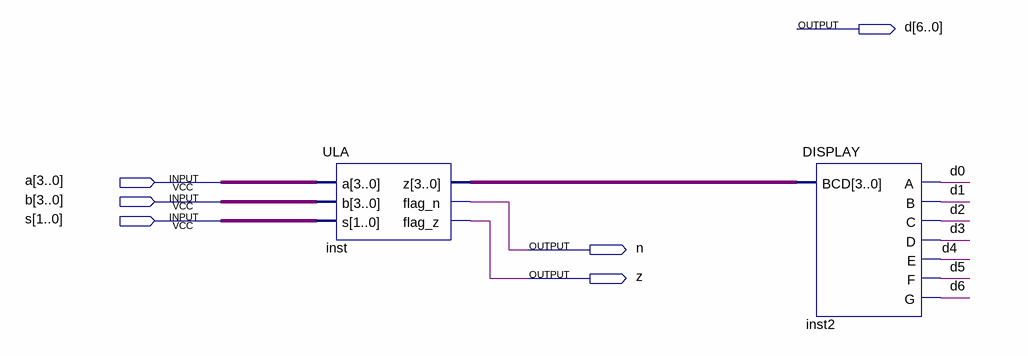
[diagram p0: schematic sheet]
// Quartus schematic ULA_DISPLAY.bdf as structural Verilog: 2 symbols, 6 pins
module ULA_DISPLAY (
  input  [3:0] a,
  input  [3:0] b,
  input  [1:0] s,
  output [6:0] d,
  output n,
  output z
);

  wire [3:0] inst_z;

  ULA inst (.a(a), .b(b), .s(s), .z(inst_z), .flag_n(n), .flag_z(z));
  DISPLAY inst2 (.BCD(inst_z), .A(d[0]), .B(d[1]), .C(d[2]), .D(d[3]), .E(d[4]), .F(d[5]), .G(d[6]));
endmodule
